# Altium schematic sheet DS3231_RTC.SchDoc: Schematic design of the RTC section
size 420 x 297 mm; Date: 24/07/2023; ApprovedBy: Sir Pramitha; CheckedBy: Sir Pramitha; Author: Intern Dilini; CompanyName: SLTMobitel; DrawnBy: Intern Dilini; Engineer: Sir Pramitha; Organization: SLT; Address1: Embryo Innovation Center; Address2: Telecom head office; DocumentNumber: 3; SheetNumber: 3; SheetTotal: 5; Time: 12:20
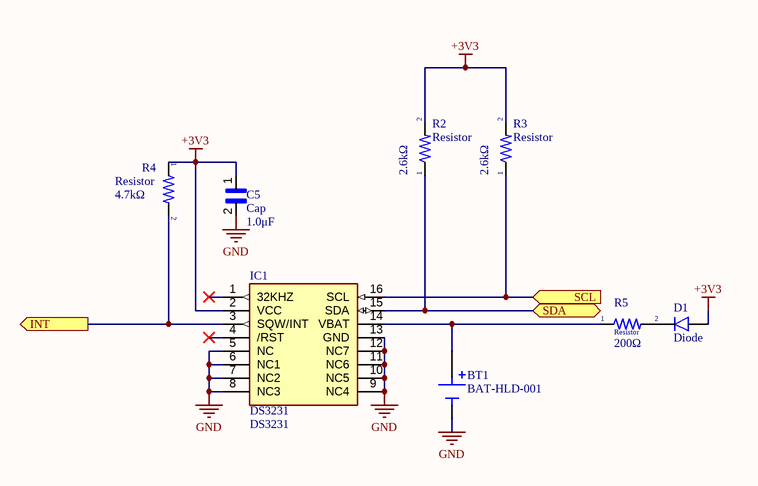
[diagram p0: DS3231_RTC.SchDoc]

## Parts
BT1  BAT-HLD-001  [BAT_BAT-HLD-001]
C5  Cap  Capacitance: 1.0μF  [Cap_0805]
D1  Diode  [Diode_SMD]
IC1  DS3231  [SO16W]
R2  Resistor  Resistance: 2.6kΩ  [Res_0603]
R3  Resistor  Resistance: 2.6kΩ  [Res_0603]
R4  Resistor  Resistance: 4.7kΩ  [Res_0603]
R5  Resistor  Resistance: 200Ω  [Res_0603]

## Ports
INT (out, see Top Design[5B], MSP430G2553_MCU[2B]), SCL (in, see Top Design[4B], MSP430G2553_MCU[2B]), SDA (bidir, see Top Design[4B], MSP430G2553_MCU[2B])

## Nets
+3V3: C5.1 D1.A IC1.2(VCC) R2.2 R3.2 R4.1
GND: BT1.N-(NEG) C5.2 IC1.5(NC) IC1.6(NC1) IC1.7(NC2) IC1.8(NC3) IC1.9(NC4) IC1.10(NC5) IC1.11(NC6) IC1.12(NC7) IC1.13(GND)
INT: IC1.3(SQW/INT) R4.2 ; port INT
SCL: IC1.16(SCL) R3.1 ; port SCL
SDA: IC1.15(SDA) R2.1 ; port SDA
NetBT1_P+: BT1.P+(POS) IC1.14(VBAT) R5.1
NetD1_C: D1.C R5.2

Not connected (* = marked no-connect by the designer): IC1 1(32KHZ)* 4(/RST)*

## Notes on the sheet
- THIS DOCUMENT AND THE DATA DISCLOSED HEREIN OR
- HEREWITH IS THE PROPERTY OF ALTIUM LIMITED AND MAY
- DWG NO:
- REVISION
- REV:
- DESCRIPTION
- DATE
- APPROVED
- BE FREELY DISTRIBUTED IN WHOLE. NO RIGHTS ARE
- RESERVED OR EXPRESS OR IMPLIED WARANTEE GIVEN.
- ENG:
- APPROVALS
- PROJECT
- DSN:
- CHK:
- REFERENCE DOCUMENTS
- PROJECT REVISION:
- TITLE
- DOCUMENT REVISION:
- DESIGN ITEM:
- BOM:
- FAB DWG:
- PCB DWG:
- ASSY DWG:
- SCALE:
- A3
- SIZE
- CAGE CODE
- FILE NAME
- DWG NO.
- SHEET
- OF
- REV

## Library data of the parts
BT1 = BAT-HLD-001: Battery Retainer Coin, 20.0mm 1 Cell SMD (SMT) Tab; Value: *; MP: BAT-HLD-001; Package: None; Availability: Unavailable; Price: None
IC1 = DS3231: Real Time Clock (RTC) IC Clock/Calendar - IÂ²C, 2-Wire Serial 8-SOIC (0.154, 3.90mm Width); MF: Maxim Integrated; Check_prices: https://www.snapeda.com/parts/DS3231/Maxim+Integrated/view-part/?ref=eda; Value: *; Availability: In Stock; MP: DS3231; Price: None; Package: SOIC-16 Maxim Integrated; SnapEDA_Link: https://www.snapeda.com/parts/DS3231/Maxim+Integrated/view-part/?ref=snap; Purchase-URL: https://pricing.snapeda.com/search/part/DS3231/?ref=eda